# Altium schematic sheet PoE.SchDoc: PoE
size A4; CompanyName: STMicroelectronics; Organization: Microcontrollers Division; DocumentNumber: 13; SheetNumber: 6; SheetTotal: 19
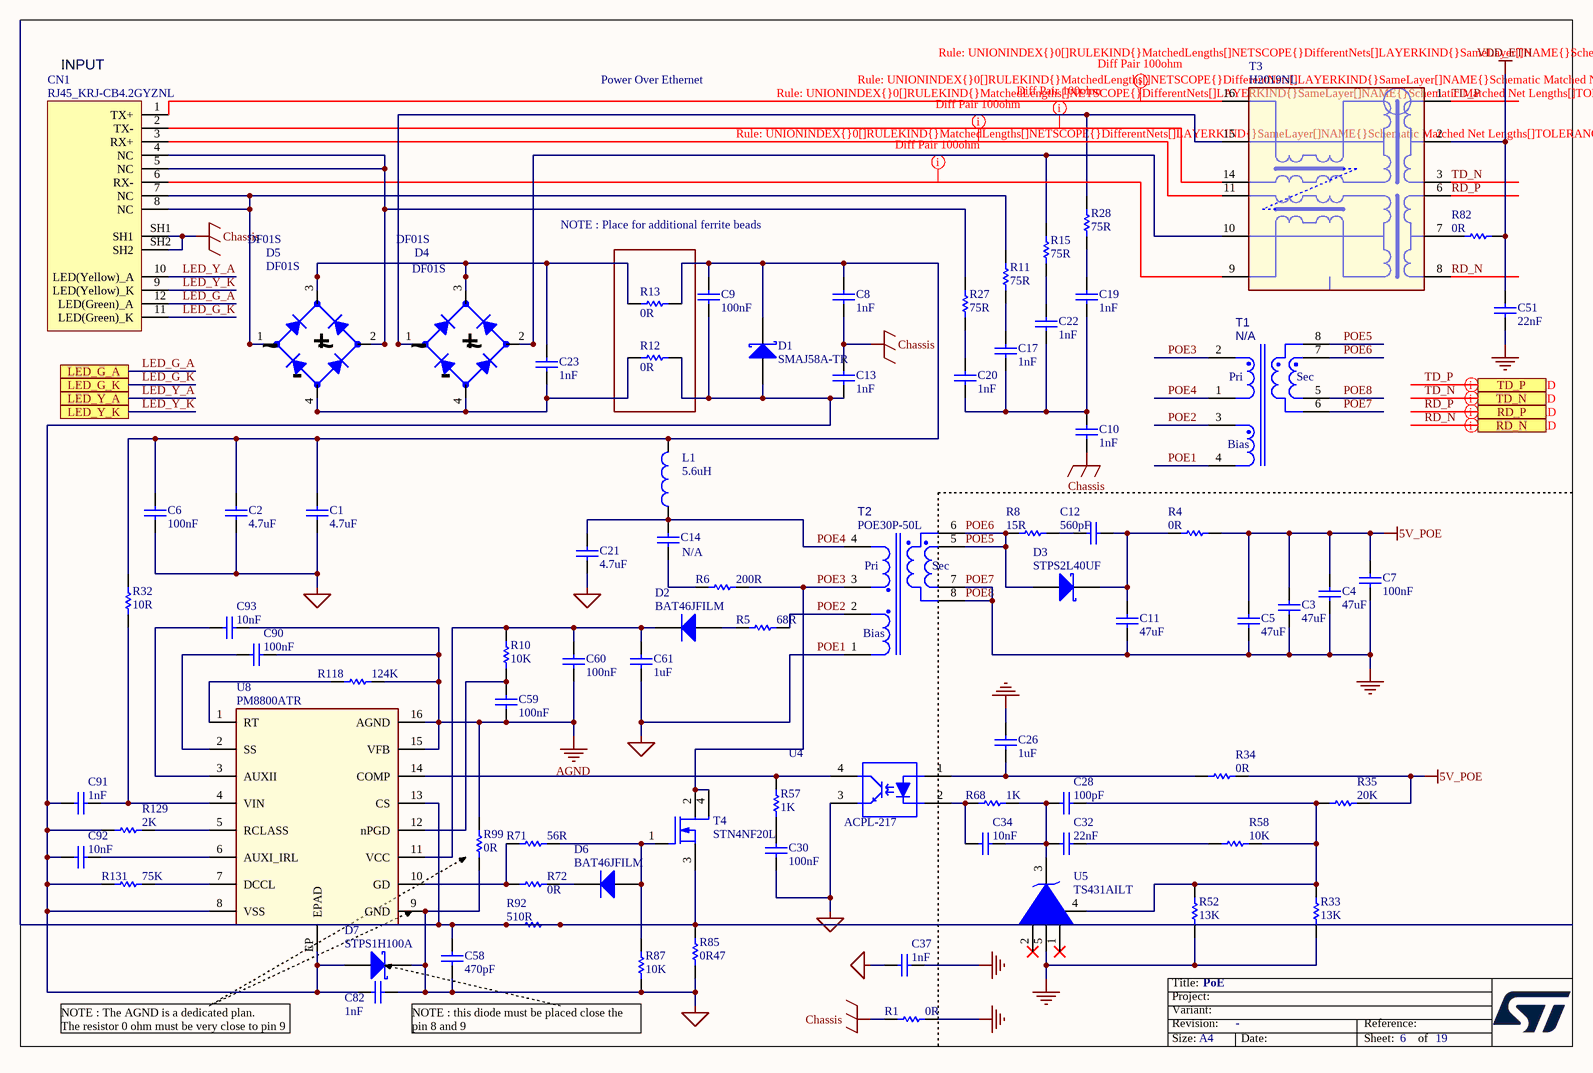
[diagram p0: PoE.SchDoc]

## Parts
C1  value 4.7uF  [C1210]  (hidden comment: Capacitor)
C2  value 4.7uF  [C1210]  (hidden comment: Capacitor)
C3  value 47uF  [C0805]  (hidden comment: Capacitor)
C4  value 47uF  [C0805]  (hidden comment: Capacitor)
C5  value 47uF  [C0805]  (hidden comment: Capacitor)
C6  value 100nF  [C0805]  (hidden comment: Capacitor)
C7  value 100nF  [C0603]  (hidden comment: Capacitor)
C8  value 1nF  [C0603]  (hidden comment: Capacitor)
C9  value 100nF  [C0805]  (hidden comment: Capacitor)
C10  value 1nF  [C1206_H1P6]  (hidden comment: Capacitor)
C11  value 47uF  [C0805]  (hidden comment: Capacitor)
C12  value 560pF  [C0603]  (hidden comment: Capacitor)
C13  value 1nF  [C0603]  (hidden comment: Capacitor)
C14  N/A  [C0603]
C17  value 1nF  [C0603]  (hidden comment: Capacitor)
C19  value 1nF  [C0603]  (hidden comment: Capacitor)
C20  value 1nF  [C0603]  (hidden comment: Capacitor)
C21  value 4.7uF  [C1210]  (hidden comment: Capacitor)
C22  value 1nF  [C0603]  (hidden comment: Capacitor)
C23  value 1nF  [C0603]  (hidden comment: Capacitor)
C26  value 1uF  [C0603]  (hidden comment: Capacitor)
C28  value 100pF  [C0603]  (hidden comment: Capacitor)
C30  value 100nF  [C0603]  (hidden comment: Capacitor)
C32  value 22nF  [C0603]  (hidden comment: Capacitor)
C34  value 10nF  [C0603]  (hidden comment: Capacitor)
C37  value 1nF  [C1206_H1P6]  (hidden comment: Capacitor)
C51  value 22nF  [C0603]  (hidden comment: Capacitor)
C58  value 470pF  [C0603]  (hidden comment: Capacitor)
C59  value 100nF  [C0603]  (hidden comment: Capacitor)
C60  value 100nF  [C0603]  (hidden comment: Capacitor)
C61  value 1uF  [C0603]  (hidden comment: Capacitor)
C82  value 1nF  [C0603]  (hidden comment: Capacitor)
C90  value 100nF  [C0603]  (hidden comment: Capacitor)
C91  value 1nF  [C0603]  (hidden comment: Capacitor)
C92  value 10nF  [C0603]  (hidden comment: Capacitor)
C93  value 10nF  [C0603]  (hidden comment: Capacitor)
CN1  RJ45_KRJ-CB4.2GYZNL  [CON_RJ45_DGKYD_KRJ-CB4.2GYZNL]
D1  value SMAJ58A-TR  [DIO_SMA_1A_2K]  (hidden comment: ​Anode = pin 1)
D2  value BAT46JFILM  [DIO_SOD323_1A_2K]  (hidden comment: DIODE)
D3  value STPS2L40UF  [DIO_SMB-FLAT_1A_2K]  (hidden comment: Anode = pin 1)
D4  DF01S  [BRF_VISHAY_DFS_DF01S]
D5  DF01S  [BRF_VISHAY_DFS_DF01S]
D6  value BAT46JFILM  [DIO_SOD323_1A_2K]  (hidden comment: DIODE)
D7  value STPS1H100A  [DIO_SMA_DO214-AC_1A_2K]  (hidden comment: SMAJ58A-TR)
L1  value 5.6uH  [IND_POWER_COILCRAFT_ME3220]
R1  value 0R  [R0805]  (hidden comment: Resistor)
R4  value 0R  [R0603]  (hidden comment: Resistor)
R5  value 68R  [R0805]  (hidden comment: Resistor)
R6  value 200R  [R1206_H0P55]  (hidden comment: Resistor)
R8  value 15R  [R0805]  (hidden comment: Resistor)
R10  value 10K  [R0603]  (hidden comment: Resistor)
R11  value 75R  [R0805]  (hidden comment: Resistor)
R12  value 0R  [R0805]  (hidden comment: Resistor)
R13  value 0R  [R0805]  (hidden comment: Resistor)
R15  value 75R  [R0805]  (hidden comment: Resistor)
R27  value 75R  [R0805]  (hidden comment: Resistor)
R28  value 75R  [R0805]  (hidden comment: Resistor)
R32  value 10R  [R0805]  (hidden comment: Resistor)
R33  value 13K  [R0603]  (hidden comment: Resistor)
R34  value 0R  [R0805]  (hidden comment: Resistor)
R35  value 20K  [R0603]  (hidden comment: Resistor)
R52  value 13K  [R0603]  (hidden comment: Resistor)
R57  value 1K  [R0603]  (hidden comment: Resistor)
R58  value 10K  [R0603]  (hidden comment: Resistor)
R68  value 1K  [R0603]  (hidden comment: Resistor)
R71  value 56R  [R0805]  (hidden comment: Resistor)
R72  value 0R  [R0805]  (hidden comment: Resistor)
R82  value 0R  [R0805]  (hidden comment: resister)
R85  value 0R47  [R1206_H0P55]  (hidden comment: Resistor)
R87  value 10K  [R0603]  (hidden comment: Resistor)
R92  value 510R  [R0603]  (hidden comment: Resistor)
R99  value 0R  [R0603]  (hidden comment: Resistor)
R118  value 124K  [R0603]  (hidden comment: Resistor)
R129  value 2K  [R0805]  (hidden comment: Resistor)
R131  value 75K  [R0603]  (hidden comment: Resistor)
T1  N/A  [TRS_WURTH_750315923]
T2  value POE30P-50L  [TRS_COILCRAFT_POE30P-50L]
T3  value H2019NL  [TRS_PULSE_H2019NL]
T4  value STN4NF20L  [MOS_SOT223-TAB]
U4  value ACPL-217  [OPT_MINI-FLAT_FAIRCHILD_HMHA2801A]  (hidden comment: HMHA2801A)
U5  TS431AILT  [MOS_SOT23-5L]
U8  value PM8800ATR  [ICC_HTSSOP16-EPAD_5X4P4_P065]

## Ports
LED_G_A, LED_G_K, LED_Y_A, LED_Y_K, RD_N, RD_P, TD_N, TD_P

## Nets
5V_POE: C3.2 C4.2 C5.2 C7.2 R4.2 R34.2 R35.2
AGND: C59.1 C60.1 C90.2 C93.2 R99.2 R118.2 U8.15(VFB) U8.16(AGND)
Chassis: C8.1 C10.1 C13.2 CN1.SH1 CN1.SH2 R1.1
POE1: C1.1 C2.1 C6.1 C21.1 C30.1 C37.1 C58.1 C61.1 C82.1 D7.2(K) R85.1 R87.1 R99.1 T1.4 T2.1 U4.3(Emitter) U8.9(GND)  [also labelled GND_POWER_IN]
POE7: C3.1 C4.1 C5.1 C7.1 C11.1 C26.2 C37.2 C51.1 R1.2 R33.2 R52.1 T1.5 T1.6 T2.7 T2.8 U5.5(A)  [also labelled GND, POE8]
VDD_ETH: C51.2 R82.2 T3.2(tct)
LED_G_A: CN1.12(LED(Green)_A) ; port LED_G_A
LED_G_K: CN1.11(LED(Green)_K) ; port LED_G_K
LED_Y_A: CN1.10(LED(Yellow)_A) ; port LED_Y_A
LED_Y_K: CN1.9(LED(Yellow)_K) ; port LED_Y_K
POE2: R5.2 T1.3 T2.2
POE3: R6.2 T1.2 T2.3 T4.2(D) T4.4(D)
POE4: C14.2 C21.2 L1.1 T1.1 T2.4
POE5: D3.1(A) R8.1 T1.7 T1.8 T2.5 T2.6  [also labelled POE6]
RD_N: T3.8(rd-) ; port RD_N
RD_P: T3.6(rd+) ; port RD_P
TD_N: T3.3(td-) ; port TD_N
TD_P: T3.1(td+) ; port TD_P
NetC1_2: C1.2 C2.2 C6.2 C8.2 C9.1 D1.2(K) L1.2 R13.2 R32.2
NetC9_2: C9.2 C13.1 C82.2 C91.2 C92.1 D1.1(A) D7.1(A) R12.2 R129.1 R131.1 U8.8(VSS) U8.EP(EPAD)
NetC10_2: C10.2 C17.1 C19.1 C20.1 C22.1
NetC11_2: C11.2 C12.2 D3.2(K) R4.1
NetC12_1: C12.1 R8.2
NetC14_1: C14.1 R6.1
NetC17_2: C17.2 R11.1
NetC19_2: C19.2 R28.1
NetC20_2: C20.2 R27.1
NetC22_2: C22.2 R15.1
NetC23_1: C23.1 D4.4(DC_OUT_MINUS) D5.4(DC_OUT_MINUS) R12.1
NetC23_2: C23.2 D4.3(DC_OUT_PLUS) D5.3(DC_OUT_PLUS) R13.1
NetC26_1: C26.1 R34.1 U4.1(Anode)
NetC28_1: C28.1 C32.1 C34.2 R68.1 U5.3(K)
NetC28_2: C28.2 R33.1 R35.1 R52.2 R58.1 U5.4(REF)
NetC30_2: C30.2 R57.1
NetC32_2: C32.2 R58.2
NetC34_1: C34.1 R68.2 U4.2(B)
NetC58_2: C58.2 R85.2 R92.1 R92.2 T4.3(S) U8.13(CS)
NetC59_2: C59.2 R10.1 U8.12(nPGD)
NetC60_2: C60.2 C61.2 D2.2(K) R10.2 U8.11(VCC)
NetC90_1: C90.1 U8.2(SS)
NetC91_1: C91.1 R32.1 U8.4(VIN)
NetC92_2: C92.2 U8.6(AUXI_IRL)
NetC93_1: C93.1 U8.3(AUXII)
NetCN1_1: CN1.1(TX+) T3.16(tx1+)
NetCN1_2: CN1.2(TX-) T3.14(tx1-)
NetCN1_3: CN1.3(RX+) T3.11(rx1+)
NetCN1_4: CN1.4(NC) CN1.5(NC) D5.2(AC_IN_2) R27.2
NetCN1_6: CN1.6(RX-) T3.9(rx-)
NetCN1_7: CN1.7(NC) CN1.8(NC) D5.1(AC_IN_1) R11.2
NetD2_1: D2.1(A) R5.1
NetD4_1: D4.1(AC_IN_1) R28.2 T3.15(txct)
NetD4_2: D4.2(AC_IN_2) R15.2 T3.10(rxct)
NetD6_1: D6.1(A) R71.2 R87.2 T4.1(G)
NetD6_2: D6.2(K) R72.1
NetR57_2: R57.2 U4.4(Collector) U8.14(COMP)
NetR71_1: R71.1 R72.2 U8.10(GD)
NetR82_1: R82.1 T3.7(rct)
NetR118_1: R118.1 U8.1(RT)
NetR129_2: R129.2 U8.5(RCLASS)
NetR131_2: R131.2 U8.7(DCCL)

Not connected (* = marked no-connect by the designer): U5 1(NC)* 2(NC)*

## Layout directives
differential pair: RD_N, RD_P, TD_N, TD_P
rule Matched Net Lengths [Tolerance = 100mil]: NetCN1_1, NetCN1_2, NetCN1_3, NetCN1_6

## Notes on the sheet
- INPUT
- Power Over Ethernet
- NOTE : Place for additional ferrite beads
- NOTE : The AGND is a dedicated plan.
  The resistor 0 ohm must be very close to pin 9
- NOTE : this diode must be placed close the pin 8 and 9
- Title:
- Project:
- Size:
- Revision:
- Variant:
- A4
- -
- Date:
- Reference:
- Sheet:
- of
- (in symbol MCD-01063) Pri; Sec; Bias
- (in symbol MCD-01065) ~; +; -
- (in symbol MCD-01081) Pri; Sec; Bias

## Library data of the parts
C1 C2 C21 = MCD-02212: Capacitor, MLCC, 4.7uF, 100V, X7S, +/-10%, 1210, T=2mm; Manufacturer_Part_Number: CGA6M3X7S2A475K200AB; Manufacturer: TDK; Part_Preference: Recommended; ID: 4312; Order_Code_RS: 111-0119; ShowFields: YES; Component_Country_Of_Origin: Unknown; Internal_Part_Number: MCD-02212; Status: Released; Part_Type: Capacitor; Package: 1210; ComponentLink1URL: http://tunmcdsvn.tun.st.com/Component_Documentation_Library/Trunk/Capacitor/TDK_CGA_Series; Order_Code_Digikey: 445-7005-1-ND; Order_Code_Farnell: 2211140RL
C3-C5 C11 = MCD-00204: Capacitor, MLCC, 47uF, 10V, X5R, 20%, 0805, T=1,25mm; Manufacturer_Part_Number: GRM21BR61A476ME15K; Manufacturer: MURATA; Part_Preference: Recommended; ECCN_US: EAR99; ECCN_EU: NEC; Provided_By: Subcon; Component_Country_Of_Origin: Japan°°; ID: 2664; ShowFields: YES; Internal_Part_Number: MCD-00204; Status: Released; Part_Type: Capacitor; Package: 0805; ComponentLink1Description: Murata_Capacitor_GR_series.pdf; ComponentLink1URL: http://tunmcdsvn.tun.st.com/Component_Documentation_Library/Trunk/Capacitor/MURATA_GRM_Series; Order_Code_Digikey: GRM21BR61A476ME15K-ND; Order_Code_Farnell: N/A; Order_Code_RS: N/A
C6 C9 = MCD-01093: Capacitor,100nF,100V,X7R,10%,0805; Manufacturer_Part_Number: C2012X7R2A104K125AA; Manufacturer: TDK; Part_Preference: Recommended; Provided_By: Subcon; Initial_Board_Reference: MB1381; Component_Country_Of_Origin: Unknown; ID: 3402; Order_Code_RS: 921-4157; ShowFields: YES; Internal_Part_Number: MCD-01093; Status: Checked; Part_Type: Capacitor; Package: 0805; ComponentLink1Description: TDK_Capacitor_C-series Commercial Grade Mid Voltage (100 to 630V).pdf; ComponentLink1URL: http://tunmcdsvn.tun.st.com/Component_Documentation_Library/Trunk/Capacitor/TDK_C_MV_Series; ECCN_US: n/a; ECCN_EU: n/a; Order_Code_Digikey: 445-1418-1-ND; Order_Code_Farnell: 1907331
C7 = MCD-00211: Capacitor, MLCC, 100nF, 16V, X7R, 10%, 0603, T=0,8mm; Manufacturer_Part_Number: CC0603KRX7R7BB104; Manufacturer: YAGEO; Part_Preference: Recommended; Partial_Alternate_Internal_Part_Number: MCD-01099; Provided_By: Subcon; Initial_Board_Reference: MB1319; Component_Country_Of_Origin: China; ID: 2659; Order_Code_RS: 669-8763; ShowFields: YES; Internal_Part_Number: MCD-00211; Status: Released; Part_Type: Capacitor; Package: 0603; ComponentLink1Description: Yageo_Capacitor_X7R-series.pdf; ComponentLink1URL: http://tunmcdsvn.tun.st.com/Component_Documentation_Library/Trunk/Capacitor/YAGEO_X7R_Series; ECCN_US: n/a; ECCN_EU: n/a; Order_Code_Digikey: 311-1088-1-ND; Order_Code_Farnell: 432210
C8 C13 C17 C19 C20 C22 C23 C82 C91 = MCD-01091: Capacitor,1nF,100V,X7R,10%,0603; Manufacturer_Part_Number: CC0603KRX7R0BB102; Manufacturer: YAGEO; Part_Preference: Recommended; Provided_By: Subcon; Initial_Board_Reference: MB1381; Component_Country_Of_Origin: China; ID: 3403; Order_Code_RS: 669-9000; ShowFields: YES; Internal_Part_Number: MCD-01091; Status: Checked; Part_Type: Capacitor; Package: 0603; ComponentLink1Description: Yageo_Multilayer_Capacitor_NPO_X7R_100V_to_630V_0.47pF to 2.2uF.pdf; ComponentLink1URL: http://tunmcdsvn.tun.st.com/Component_Documentation_Library/Trunk/Capacitor/YAGEO_NP0_X7R_MV_Series; ECCN_US: n/a; ECCN_EU: n/a; Order_Code_Digikey: 311-1467-1-ND; Order_Code_Farnell: 1284118
C10 C37 = MCD-00722: Capacitor, MLCC, 1nF, 2KV, X7R, 10%, 1206, T=1,25mm; Manufacturer_Part_Number: CC1206KKX7RDBB102; Manufacturer: YAGEO; Part_Preference: Recommended; Provided_By: Subcon; Initial_Board_Reference: MB1271; Component_Country_Of_Origin: China; ID: 3027; ShowFields: YES; Internal_Part_Number: MCD-00722; Status: Released; Part_Type: Capacitor; Package: 1206; ComponentLink1Description: Yageo_Multilayer_Capacitor_NPO_X7R_1KV_to_3KV_10pF_to_33nF.pdf; ComponentLink1URL: http://tunmcdsvn.tun.st.com/Component_Documentation_Library/Trunk/Capacitor/YAGEO_NP0_X7R_HV_Series; ECCN_US: n/a; ECCN_EU: n/a; Order_Code_Digikey: 311-1487-1-ND; Order_Code_Farnell: 1779513; Order_Code_RS: N/A
C12 = MCD-01095: Capacitor,560pF,16V,X7R,10%,0603; Manufacturer_Part_Number: 0603YC561KAT2A; Manufacturer: AVX; Part_Preference: Recommended; Provided_By: Subcon; Initial_Board_Reference: MB1381; Component_Country_Of_Origin: China; ID: 3400; ShowFields: YES; Internal_Part_Number: MCD-01095; Status: Checked; Part_Type: Capacitor; Package: 0603; ComponentLink1Description: AVX_X7R-series.pdf; ComponentLink1URL: http://tunmcdsvn.tun.st.com/Component_Documentation_Library/Trunk/Capacitor/AVX_X7R_Series; ECCN_US: n/a; ECCN_EU: n/a; Order_Code_Digikey: 0603YC561KAT2A-ND; Order_Code_Farnell: N/A; Order_Code_RS: N/A
C14 = MCD-01096: Capacitor,27pF,100V,NPO,5%,0603; Manufacturer_Part_Number: CC0603JRNPO0BN270; Manufacturer: YAGEO; Part_Preference: Recommended; Provided_By: Subcon; Initial_Board_Reference: MB1381; Component_Country_Of_Origin: China; ID: 3394; ShowFields: YES; Internal_Part_Number: MCD-01096; Value: 27pF; Status: Checked; Part_Type: Capacitor; Package: 0603; ComponentLink1Description: Yageo_Multilayer_Capacitor_NPO_X7R_100V_to_630V_0.47pF to 2.2uF.pdf; ComponentLink1URL: http://tunmcdsvn.tun.st.com/Component_Documentation_Library/Trunk/Capacitor/YAGEO_NP0_X7R_MV_Series; ECCN_US: n/a; ECCN_EU: n/a; Order_Code_Digikey: 311-1757-1-ND; Order_Code_Farnell: N/A; Order_Code_RS: N/A
C26 C61 = MCD-01100: Capacitor,1uF,25V,X5R,10%,0603; Manufacturer_Part_Number: CC0603KRX5R8BB105; Manufacturer: YAGEO; BMS_Part_Number: 9142279; Part_Preference: Recommended; Provided_By: Subcon; Initial_Board_Reference: MB1381; Component_Country_Of_Origin: China; ID: 3398; ShowFields: YES; Internal_Part_Number: MCD-01100; Status: Released; Part_Type: Capacitor; Package: 0603; ComponentLink1Description: Yageo_Multilayer_capacitor_X5R_100pF_to_100uF.pdf; ComponentLink1URL: http://tunmcdsvn.tun.st.com/Component_Documentation_Library/Trunk/Capacitor/YAGEO_X5R_Series; ECCN_US: N/A; ECCN_EU: N/A; Order_Code_Digikey: 311-1445-1-ND; Order_Code_Farnell: 2370681; Order_Code_RS: N/A
C28 = MCD-01101: Capacitor,100pF,50V,X7R,10%,0603; Manufacturer_Part_Number: 06035C101JAT4A; Manufacturer: AVX; Part_Preference: Recommended; Provided_By: Subcon; Initial_Board_Reference: MB1381; Component_Country_Of_Origin: China; ID: 3399; ShowFields: YES; Internal_Part_Number: MCD-01101; Status: Checked; Part_Type: Capacitor; Package: 0603; ComponentLink1Description: AVX_X7R-series.pdf; ComponentLink1URL: http://tunmcdsvn.tun.st.com/Component_Documentation_Library/Trunk/Capacitor/AVX_X7R_Series; ECCN_US: n/a; ECCN_EU: n/a; Order_Code_Digikey: 06035C101JAT4A-ND; Order_Code_Farnell: 2332634; Order_Code_RS: N/A
C30 C59 C60 C90 = MCD-01099: Capacitor,100nF,50V,X7R,10%,0603; Manufacturer_Part_Number: CC0603KRX7R9BB104; Manufacturer: YAGEO; BMS_Part_Number: 9142278; Part_Preference: Recommended; Provided_By: Subcon; Initial_Board_Reference: MB1381; Component_Country_Of_Origin: China; ID: 3397; Order_Code_RS: 669-8767; ShowFields: YES; Internal_Part_Number: MCD-01099; Status: Released; Part_Type: Capacitor; Package: 0603; ComponentLink1Description: Yageo_Mutilayer_Capacitor_X7R_100pF_to_22uF.pdf; ComponentLink1URL: http://tunmcdsvn.tun.st.com/Component_Documentation_Library/Trunk/Capacitor/YAGEO_X7R_Series; ECCN_US: n/a; ECCN_EU: n/a; Order_Code_Digikey: 311-1344-1-ND; Order_Code_Farnell: 1362556; Partial_Alternate_Internal_Part_Number: MCD-0211
C32 C51 = MCD-01103: Capacitor,22nF,50V,X7R,10%,0603; Manufacturer_Part_Number: CC0603KRX7R9BB223; Manufacturer: YAGEO; BMS_Part_Number: 9142231; Part_Preference: Recommended; Provided_By: Subcon; Initial_Board_Reference: MB1381; Component_Country_Of_Origin: China; ID: 3390; ShowFields: YES; Internal_Part_Number: MCD-01103; Status: Checked; Part_Type: Capacitor; Package: 0603; ComponentLink1Description: Yageo_Mutilayer_Capacitor_X7R_100pF_to_22uF.pdf; ComponentLink1URL: http://tunmcdsvn.tun.st.com/Component_Documentation_Library/Trunk/Capacitor/YAGEO_X7R_Series; ECCN_US: n/a; ECCN_EU: n/a; Order_Code_Digikey: 311-1370-1-ND; Order_Code_Farnell: 3019755; Order_Code_RS: N/A
C34 = MCD-00017: Capacitor, MLCC, 10nF, 50V, X7R, +/-10%, 0603, T=0.8mm; Manufacturer_Part_Number: CC0603KRX7R9BB103; Manufacturer: YAGEO; Part_Preference: Recommended; Component_Country_Of_Origin: China; ID: 2500; Order_Code_RS: 722236; ShowFields: YES; Internal_Part_Number: MCD-00017; Status: Released; Part_Type: Capacitor; ComponentLink1URL: http://tunmcdsvn.tun.st.com/Component_Documentation_Library/Trunk/Capacitor/YAGEO_X7R_Series; Order_Code_Digikey: 311-1085-1-ND; Order_Code_Farnell: 722236; Package: 0603
C58 = MCD-01104: Capacitor,470pF,100V,X7R,10%,0603; Manufacturer_Part_Number: 06031C471KAT2A; Manufacturer: AVX; Part_Preference: Recommended; Partial_Alternate_Internal_Part_Number: MCD-01731; Provided_By: Subcon; Initial_Board_Reference: MB1381; Component_Country_Of_Origin: China; ID: 3393; Order_Code_RS: 888-2112; ShowFields: YES; Internal_Part_Number: MCD-01104; Status: Checked; Part_Type: Capacitor; Package: 0603; ComponentLink1Description: AVX_Capacitor_X7S-Dielectric.pdf; ComponentLink1URL: http://tunmcdsvn.tun.st.com/Component_Documentation_Library/Trunk/Capacitor/AVX_X7S_Series; ECCN_US: n/a; ECCN_EU: n/a; Order_Code_Digikey: 478-1197-1-ND; Order_Code_Farnell: 2280645
C92 C93 = MCD-01098: Capacitor,10nF,100V,X7R,10%,0603; Manufacturer_Part_Number: CC0603KRX7R0BB103; Manufacturer: YAGEO; Part_Preference: Recommended; Provided_By: Subcon; Initial_Board_Reference: MB1381; Component_Country_Of_Origin: China; ID: 3396; ShowFields: YES; Internal_Part_Number: MCD-01098; Status: Checked; Part_Type: Capacitor; Package: 0603; ComponentLink1Description: Yageo_Multilayer_Capacitor_NPO_X7R_100V_to_630V_0.47pF to 2.2uF.pdf; ComponentLink1URL: http://tunmcdsvn.tun.st.com/Component_Documentation_Library/Trunk/Capacitor/YAGEO_NP0_X7R_MV_Series; ECCN_US: n/a; ECCN_EU: n/a; Order_Code_Digikey: 311-1788-1-ND; Order_Code_Farnell: 1284119; Order_Code_RS: N/A
CN1 = MCD-00717: RJ45 jack, single port, with LEDS, Metal shielded dip low profile; Part_Type: Connector; Manufacturer: DONGGUAN KEYOUDA ELECTRONIC TECHNOLOGY; Part_Preference: Recommended; Provided_By: Subcon; Initial_Board_Reference: MB1271; Component_Country_Of_Origin: Unknown; ID: 3029; ShowFields: YES; Internal_Part_Number: MCD-00717; Value: RJ45_KRJ-CB4.2GYZNL; Status: Released; Manufacturer_Part_Number: KRJ-CB4.2GYZNL; ComponentLink1Description: DGKYD_RJ45_KRJ-CB4.2GYZNL; ComponentLink1URL: http://tunmcdsvn.tun.st.com/Component_Documentation_Library/Trunk/Connector/DONGGUAN_KEYOUDA_ELECTRONIC_TECHNOLOGY_KRJ-CB4.2GYZNL/; ECCN_US: n/a; ECCN_EU: n/a; Order_Code_Digikey: N/A; Order_Code_Farnell: N/A; Order_Code_RS: N/A
D1 = MCD-01083: Transil 400W, VRM=58V; Part_Type: Diode; Manufacturer: STMICROELECTRONICS; BMS_Part_Number: 9151124; Manufacturer_HQ_COO: EU; Part_Preference: Recommended; ECCN_US: EAR99; ECCN_EU: NEC; Provided_By: Subcon; Initial_Board_Reference: MB1381; Component_Country_Of_Origin: China; ID: 3407; Order_Code_RS: 714-7128; ShowFields: YES; Internal_Part_Number: MCD-01083; Status: Released; Manufacturer_Part_Number: SMAJ58A-TR; Package: SMA; ComponentLink1Description: STM_Diode_SMAJ58A-TR.pdf; ComponentLink1URL: http://tunmcdsvn.tun.st.com/Component_Documentation_Library/Trunk/Diode/STMICROELECTRONICS_SMAJ_Series; Order_Code_Digikey: 497-3508-2-ND; Order_Code_Farnell: 1373661
D2 D6 = MCD-01064: Schottky Single diode,150mA, 100V; Manufacturer: STMICROELECTRONICS; BMS_Part_Number: 9151125; Manufacturer_HQ_COO: EU; Part_Preference: Recommended; ECCN_US: EAR99; ECCN_EU: NEC; Provided_By: Subcon; Initial_Board_Reference: MB1381; ID: 3424; Order_Code_RS: 714-6847; ShowFields: YES; Internal_Part_Number: MCD-01064; Status: Released; Part_Type: Diode; Manufacturer_Part_Number: BAT46JFILM; Package: SOD323; ComponentLink1Description: STM_Diode_BAT60JFILM-SOD323.pdf; ComponentLink1URL: http://tunmcdsvn.tun.st.com/Component_Documentation_Library/Trunk/Diode/STMICROELECTRONICS_BAT60J_Series; Order_Code_Digikey: 497-6653-2-ND; Order_Code_Farnell: 2341641
D3 = MCD-01087: Low drop power Schottky rectifier(2A, 40V, 0.34V); Part_Type: Diode; Manufacturer: STMICROELECTRONICS; BMS_Part_Number: 9151009; Manufacturer_HQ_COO: EU; Part_Preference: Recommended; ECCN_US: EAR99; ECCN_EU: NEC; Provided_By: Subcon; Initial_Board_Reference: MB1381; Component_Country_Of_Origin: China; ID: 3406; ShowFields: YES; Internal_Part_Number: MCD-01087; Status: Released; Manufacturer_Part_Number: STPS2L40UF; Package: SMBflat; ComponentLink1Description: STM_Schottky_STPS2L40UF.pdf; ComponentLink1URL: http://tunmcdsvn.tun.st.com/Component_Documentation_Library/Trunk/Diode/STMICROELECTRONICS_STPS2L40_Series; Order_Code_Digikey: 497-8031-2-ND; Order_Code_Farnell: 3214533; Order_Code_RS: N/A
D4 D5 = MCD-01065: IC, Bridge Rectifiers, Miniature Glass Passivated Single-Phase, Surface Mount; Part_Preference: Forbidden; Manufacturer: VISHAY; ShowFields: YES; ID: 3428; Internal_Part_Number: MCD-01065; Status: Obsolete; Part_Type: IC; Manufacturer_Part_Number: DF01S; Package: DFS; ComponentLink1URL: http://tunmcdsvn.tun.st.com/Component_Documentation_Library/Trunk/IC/VISHAY_DF01S; Order_Code_Digikey: N/A; Order_Code_Farnell: N/A; Order_Code_RS: N/A; Value: DF01S
D7 = MCD-01165: High voltage power Schottky rectifier; Part_Type: Diode; Manufacturer: STMICROELECTRONICS; BMS_Part_Number: 9151102; Manufacturer_HQ_COO: EU; Part_Preference: Forbidden; ECCN_US: EAR99; ECCN_EU: NEC; Provided_By: Subcon; Initial_Board_Reference: MB1381; ID: 3327; Order_Code_RS: 249-892; ShowFields: YES; Internal_Part_Number: MCD-01165; Status: Released; Manufacturer_Part_Number: STPS1H100A; ComponentLink1Description: http://tunmcdsvn.tun.st.com/Component_Datasheet_Library/Trunk/Diodes/STM_SCHOTTKY_STPS1H100A; ComponentLink1URL: http://tunmcdsvn.tun.st.com/Component_Documentation_Library/Trunk/Diode/STMICROELECTRONICS_STPS1H100_Series; Order_Code_Digikey: 497-3209-2-ND; Order_Code_Farnell: 1467549; Package: SMB
L1 = MCD-01109: Power Inductor, 5.6uH, 0.2R, ME3220-562ML; Manufacturer: COILCRAFT; Part_Preference: Recommended; Provided_By: Subcon; Initial_Board_Reference: MB1381; Component_Country_Of_Origin: Unknown; ID: 3389; ShowFields: YES; Internal_Part_Number: MCD-01109; Status: Checked; Part_Type: Inductor; Manufacturer_Part_Number: ME3220-562ML; ComponentLink1Description: CoilCraft_SMT Power Inductor ME3220.pdf; ComponentLink1URL: http://tunmcdsvn.tun.st.com/Component_Documentation_Library/Trunk/Inductor/COILCRAFT_ME3220_Series; ECCN_US: n/a; ECCN_EU: n/a; Order_Code_Digikey: N/A; Order_Code_Farnell: 2287944; Order_Code_RS: N/A; Package: 1210
R1 R12 R13 R34 R72 R82 = MCD-00179: Resistor,0R,0805,5%; Manufacturer_Part_Number: RC0805JR-070RL; Manufacturer: YAGEO; Part_Preference: Recommended; Provided_By: Subcon; Component_Country_Of_Origin: China; ID: 2685; ShowFields: YES; Internal_Part_Number: MCD-00179; Status: Released; Part_Type: Resistor; Package: 0805; ComponentLink1Description: Yageo_Resistor_RC0805-series.pdf; ComponentLink1URL: http://tunmcdsvn.tun.st.com/Component_Documentation_Library/Trunk/Resistor/YAGEO_RC_L_Series; ECCN_US: n/a; ECCN_EU: n/a; Order_Code_Digikey: 311-0.0ARCT-ND; Order_Code_Farnell: 9233750; Order_Code_RS: N/A
R4 R99 = MCD-00056: Resistor,0R,0603,5%,1/10W; Manufacturer_Part_Number: RC0603JR-070RL; Manufacturer: YAGEO; Part_Preference: Recommended; Provided_By: subcon; Initial_Board_Reference: MB1274; Component_Country_Of_Origin: China; ID: 2536; Order_Code_RS: 9233130RL; ShowFields: YES; Internal_Part_Number: MCD-00056; Status: Released; Part_Type: Resistor; Package: 0603; ComponentLink1Description: Yageo_Resistor_RC0603-series.pdf; ComponentLink1URL: http://tunmcdsvn.tun.st.com/Component_Documentation_Library/Trunk/Resistor/YAGEO_RC_L_Series; ECCN_US: n/a; ECCN_EU: n/a; Order_Code_Digikey: 311-0.0GRCT-ND; Order_Code_Farnell: 9233130RL
R5 = MCD-01115: Resistor,68R,0805,1%; Manufacturer_Part_Number: RC0805FR-0768RL; Manufacturer: YAGEO; Part_Preference: Recommended; Provided_By: Subcon; Initial_Board_Reference: MB1381; Component_Country_Of_Origin: China; ID: 3379; ShowFields: YES; Internal_Part_Number: MCD-01115; Status: Checked; Part_Type: Resistor; Package: 0805; ComponentLink1Description: Yageo_Resistor_RC0805-series.pdf; ComponentLink1URL: http://tunmcdsvn.tun.st.com/Component_Documentation_Library/Trunk/Resistor/YAGEO_RC_L_Series; ECCN_US: n/a; ECCN_EU: n/a; Order_Code_Digikey: 311-68.0CRCT-ND; Order_Code_Farnell: 9237348; Order_Code_RS: N/A
R6 = MCD-01114: Resistor,200R,1206,1%; Manufacturer_Part_Number: LTR18EZPF2000; Manufacturer: ROHM SEMICONDUCTOR; Part_Preference: Recommended; Provided_By: Subcon; Initial_Board_Reference: MB1381; Component_Country_Of_Origin: Philippines, Thailand°°; ID: 3381; ShowFields: YES; Internal_Part_Number: MCD-01114; Status: Released; Part_Type: Resistor; Package: 1206; ComponentLink1Description: ROHM_Resistor_LTR-series.pdf; ComponentLink1URL: http://tunmcdsvn.tun.st.com/Component_Documentation_Library/Trunk/Resistor/ROHM_LTR_Series; ECCN_US: n/a; ECCN_EU: n/a; Order_Code_Digikey: RHM200YCT-ND; Order_Code_Farnell: N/A; Order_Code_RS: N/A
R8 = MCD-01113: Resistor,15R,0805,1%; Manufacturer_Part_Number: RC0805FR-0715RL; Manufacturer: YAGEO; Part_Preference: Recommended; Provided_By: Subcon; Initial_Board_Reference: MB1381; Component_Country_Of_Origin: China; ID: 3383; Order_Code_RS: 618-3476; ShowFields: YES; Internal_Part_Number: MCD-01113; Status: Released; Part_Type: Resistor; Package: 0805; ComponentLink1Description: Yageo_Resistor_RC0805-series.pdf; ComponentLink1URL: http://tunmcdsvn.tun.st.com/Component_Documentation_Library/Trunk/Resistor/YAGEO_RC_L_Series; ECCN_US: n/a; ECCN_EU: n/a; Order_Code_Digikey: 311-15.0CRCT-ND; Order_Code_Farnell: 9237267
R10 R58 R87 = MCD-00220: Resistor,10K,0603,1%,1/10W; Manufacturer_Part_Number: RC0603FR-0710KL; Manufacturer: YAGEO; Part_Preference: Recommended; Provided_By: Subcon; Initial_Board_Reference: MB1319; Component_Country_Of_Origin: China; ID: 2649; ShowFields: YES; Internal_Part_Number: MCD-00220; Status: Released; Part_Type: Resistor; Package: 0603; ComponentLink1Description: Yageo_Resistor_RC0603-series.pdf; ComponentLink1URL: http://tunmcdsvn.tun.st.com/Component_Documentation_Library/Trunk/Resistor/YAGEO_RC_L_Series; ECCN_US: n/a; ECCN_EU: n/a; Order_Code_Digikey: 311-10.0KHRCT-ND; Order_Code_Farnell: 9238603; Order_Code_RS: N/A
R11 R15 R27 R28 = MCD-01112: Resistor,75R,0805,1%; Manufacturer_Part_Number: RC0805FR-0775RL; Manufacturer: YAGEO; Part_Preference: Recommended; Provided_By: Subcon; Initial_Board_Reference: MB1381; Component_Country_Of_Origin: China; ID: 3380; ShowFields: YES; Internal_Part_Number: MCD-01112; Status: Released; Part_Type: Resistor; Package: 0805; ComponentLink1Description: Yageo_Resistor_RC0805-series.pdf; ComponentLink1URL: http://tunmcdsvn.tun.st.com/Component_Documentation_Library/Trunk/Resistor/YAGEO_RC_L_Series; ECCN_US: n/a; ECCN_EU: n/a; Order_Code_Digikey: 311-75.0CRCT-ND; Order_Code_Farnell: N/A; Order_Code_RS: N/A
R32 = MCD-01111: Resistor,10R,0805,1%,Stackpole,1/4W; Manufacturer_Part_Number: RNCP0805FTD10R0; Part_Preference: Recommended; Provided_By: Subcon; Initial_Board_Reference: MB1381; Component_Country_Of_Origin: Taiwan°; ID: 3385; ShowFields: YES; Internal_Part_Number: MCD-01111; Status: Released; Part_Type: Resistor; Manufacturer: STACKPOLE; Package: 0805; ComponentLink1Description: Stackpole_Resisteor_RNCP Series.pdf; ComponentLink1URL: http://tunmcdsvn.tun.st.com/Component_Documentation_Library/Trunk/Resistor/STACKPOLE_RNCP_Series; ECCN_US: n/a; ECCN_EU: n/a; Order_Code_Digikey: RNCP0805FTD10R0CT-ND; Order_Code_Farnell: N/A; Order_Code_RS: N/A
R33 R52 = MCD-00384: Resistor,13K,0603,1%,1/10W; Manufacturer_Part_Number: RC0603FR-0713KL; Manufacturer: YAGEO; Part_Preference: Recommended; Provided_By: Subcon; Component_Country_Of_Origin: China; ID: 2894; ShowFields: YES; Internal_Part_Number: MCD-00384; Status: Released; Part_Type: Resistor; Package: 0603; ComponentLink1Description: Yageo_Resistor_RC0603-series.pdf; ComponentLink1URL: http://tunmcdsvn.tun.st.com/Component_Documentation_Library/Trunk/Resistor/YAGEO_RC_L_Series; ECCN_US: n/a; ECCN_EU: n/a; Order_Code_Digikey: 311-13.0KHRCT-ND; Order_Code_Farnell: 1799325; Order_Code_RS: N/A
R35 = MCD-00422: Resistor,20K,0603,1%,1/10W; Manufacturer_Part_Number: RC0603FR-0720KL; Manufacturer: YAGEO; Part_Preference: Recommended; Provided_By: Subcon; Component_Country_Of_Origin: China; ID: 2854; ShowFields: YES; Internal_Part_Number: MCD-00422; Status: Released; Part_Type: Resistor; Package: 0603; ComponentLink1Description: Yageo_Resistor_RC0603-series.pdf; ComponentLink1URL: http://tunmcdsvn.tun.st.com/Component_Documentation_Library/Trunk/Resistor/YAGEO_RC_L_Series; ECCN_US: n/a; ECCN_EU: n/a; Order_Code_Digikey: 311-20.0KHRCT-ND; Order_Code_Farnell: 1799331; Order_Code_RS: N/A
R57 R68 = MCD-00070: Resistor,1K,0603,1%,1/10W; Manufacturer_Part_Number: RC0603FR-071KL; Manufacturer: YAGEO; Part_Preference: Recommended; Provided_By: Subcon; Initial_Board_Reference: MB1274; Component_Country_Of_Origin: China; ID: 2522; Order_Code_RS: 9238484RL; ShowFields: YES; Internal_Part_Number: MCD-00070; Status: Released; Part_Type: Resistor; Package: 0603; ComponentLink1Description: Yageo_Resistor_RC0603-series.pdf; ComponentLink1URL: http://tunmcdsvn.tun.st.com/Component_Documentation_Library/Trunk/Resistor/YAGEO_RC_L_Series; ECCN_US: n/a; ECCN_EU: n/a; Order_Code_Digikey: 311-1.00KHRCT-ND; Order_Code_Farnell: 9238484RL
R71 = MCD-01118: Resistor,56R,0805,1%; Manufacturer_Part_Number: RC0805FR-0756RL; Manufacturer: YAGEO; Part_Preference: Recommended; Provided_By: Subcon; Initial_Board_Reference: MB1381; Component_Country_Of_Origin: China; ID: 3376; ShowFields: YES; Internal_Part_Number: MCD-01118; Status: Checked; Part_Type: Resistor; Package: 0805; ComponentLink1Description: Yageo_Resistor_RC0805-series.pdf; ComponentLink1URL: http://tunmcdsvn.tun.st.com/Component_Documentation_Library/Trunk/Resistor/YAGEO_RC_L_Series; ECCN_US: n/a; ECCN_EU: n/a; Order_Code_Digikey: 311-56.0CRCT-ND; Order_Code_Farnell: 9237330; Order_Code_RS: N/A
R85 = MCD-01119: Resistor,0.47R,1206,1%; Manufacturer_Part_Number: RL1206FR-070R47L; Manufacturer: YAGEO; Part_Preference: Recommended; Provided_By: Subcon; Initial_Board_Reference: MB1381; Component_Country_Of_Origin: Taiwan; ID: 3382; ShowFields: YES; Internal_Part_Number: MCD-01119; Status: Checked; Part_Type: Resistor; Package: 1206; ComponentLink1Description: Yageo_Resistor_RL-series.pdf; ComponentLink1URL: http://tunmcdsvn.tun.st.com/Component_Documentation_Library/Trunk/Resistor/YAGEO_RL_Series; ECCN_US: n/a; ECCN_EU: n/a; Order_Code_Digikey: 311-.47LWCT-ND; Order_Code_Farnell: 1779456; Order_Code_RS: N/A
R92 = MCD-00225: Resistor,510R,0603,1%,1/10W; Manufacturer_Part_Number: RC0603FR-07510RL; Manufacturer: YAGEO; Part_Preference: Recommended; Provided_By: Subcon; Initial_Board_Reference: MB1319; Component_Country_Of_Origin: China; ID: 2644; ShowFields: YES; Internal_Part_Number: MCD-00225; Status: Released; Part_Type: Resistor; Package: 0603; ComponentLink1Description: Yageo_Resistor_RC0603-series.pdf; ComponentLink1URL: http://tunmcdsvn.tun.st.com/Component_Documentation_Library/Trunk/Resistor/YAGEO_RC_L_Series; ECCN_US: n/a; ECCN_EU: n/a; Order_Code_Digikey: 311-510HRCT-ND; Order_Code_Farnell: 1799351; Order_Code_RS: N/A
R118 = MCD-01116: Resistor,124K,0603,1%; Manufacturer_Part_Number: RC0603FR-07124KL; Manufacturer: YAGEO; Part_Preference: Recommended; Provided_By: Subcon; Initial_Board_Reference: MB1381; Component_Country_Of_Origin: China; ID: 3377; ShowFields: YES; Internal_Part_Number: MCD-01116; Status: Released; Part_Type: Resistor; Package: 0603; ComponentLink1Description: Yageo_Resistor_RC0603-series.pdf; ComponentLink1URL: http://tunmcdsvn.tun.st.com/Component_Documentation_Library/Trunk/Resistor/YAGEO_RC_L_Series; ECCN_US: n/a; ECCN_EU: n/a; Order_Code_Digikey: 311-124KHRCT-ND; Order_Code_Farnell: N/A; Order_Code_RS: N/A
R129 = MCD-01117: Resistor,2K,0805,1%; Manufacturer_Part_Number: RC0805FR-072KL; Manufacturer: YAGEO; Part_Preference: Recommended; Provided_By: Subcon; Initial_Board_Reference: MB1381; Component_Country_Of_Origin: China; ID: 3378; ShowFields: YES; Internal_Part_Number: MCD-01117; Status: Released; Part_Type: Resistor; Package: 0805; ComponentLink1Description: Yageo_Resistor_RC0805-series.pdf; ComponentLink1URL: http://tunmcdsvn.tun.st.com/Component_Documentation_Library/Trunk/Resistor/YAGEO_RC_L_Series; ECCN_US: n/a; ECCN_EU: n/a; Order_Code_Digikey: 311-2.00KCRCT-ND; Order_Code_Farnell: 1857143; Order_Code_RS: N/A
R131 = MCD-00522: Resistor,75K,0603,1%,1/10W; Manufacturer_Part_Number: RC0603FR-0775KL; Manufacturer: YAGEO; Part_Preference: Recommended; Provided_By: Subcon; Component_Country_Of_Origin: China; ID: 3221; ShowFields: YES; Internal_Part_Number: MCD-00522; Status: Released; Part_Type: Resistor; Package: 0603; ComponentLink1Description: Yageo_Resistor_RC0603-series.pdf; ComponentLink1URL: http://tunmcdsvn.tun.st.com/Component_Documentation_Library/Trunk/Resistor/YAGEO_RC_L_Series; ECCN_US: n/a; ECCN_EU: n/a; Order_Code_Digikey: 311-75.0KHRCT-ND; Order_Code_Farnell: 1799354; Order_Code_RS: N/A
T1 = MCD-01063: Flyback Transformers for 3 Watt, PoE applications; Part_Type: IC; Manufacturer: WURTH ELEKTRONIK; Part_Preference: Recommended; Value: 750315923; Provided_By: Subcon; Initial_Board_Reference: MB1381; Component_Country_Of_Origin: Unknown; ID: 3426; ShowFields: YES; Internal_Part_Number: MCD-01063; Status: Checked; Manufacturer_Part_Number: 750315923; ComponentLink1Description: Wurth_Transformer_750315923.pdf; ComponentLink1URL: http://tunmcdsvn.tun.st.com/Component_Documentation_Library/Trunk/IC/WURTH_ELEKTRONIK_750315923; ECCN_US: n/a; ECCN_EU: n/a; Order_Code_Digikey: N/A; Order_Code_Farnell: N/A; Order_Code_RS: N/A; Package: 12.85x12.04x6.1mm
T2 = MCD-01081: Flyback Transformers for 3 Watt, PoE applications, CoilCraft Cyntec; Part_Type: IC; Part_Preference: Recommended; Provided_By: Subcon; Initial_Board_Reference: MB1381; Component_Country_Of_Origin: Unknown; ID: 3409; ShowFields: YES; Internal_Part_Number: MCD-01081; Status: Released; Manufacturer_Part_Number: POE30P-50L; Manufacturer: COILCRAFT; ComponentLink1Description: CoilCraft_Transformer_POE30P-50L.pdf; ComponentLink1URL: http://tunmcdsvn.tun.st.com/Component_Documentation_Library/Trunk/IC/COILCRAFT_POE30P-50L; ECCN_US: n/a; ECCN_EU: n/a; Order_Code_Digikey: N/A; Order_Code_Farnell: 2458016; Order_Code_RS: N/A; Package: 13.21x10.92x9.02mm
T3 = MCD-01067: 10/100BASE-TX VoIP Magnetics Modules, Data Transformer; Part_Type: IC; Manufacturer: PULSE ELECTRONICS; Part_Preference: Recommended; ECCN_US: EAR99; ECCN_EU: NEC; Provided_By: Subcon; Initial_Board_Reference: MB1381; Component_Country_Of_Origin: China; ID: 3423; ShowFields: YES; Internal_Part_Number: MCD-01067; Status: Released; Manufacturer_Part_Number: H2019NL; ComponentLink1Description: Pulse_Transformer_H2019NL.pdf; ComponentLink1URL: http://tunmcdsvn.tun.st.com/Component_Documentation_Library/Trunk/IC/PULSE_ELECTRONICS_H2019NL; Order_Code_Digikey: N/A; Order_Code_Farnell: N/A; Order_Code_RS: N/A; Package: 9.4x12.7x5.97mm
T4 = MCD-01086: Annel 200 V, 1.1ohm, 1 A, low gate charge STripFET II, Power MOSFET; Part_Type: Transistor; Manufacturer: STMICROELECTRONICS; BMS_Part_Number: 9153018; Manufacturer_HQ_COO: EU; Part_Preference: Forbidden; ECCN_US: EAR99; ECCN_EU: NEC; Provided_By: Subcon; Initial_Board_Reference: MB1381; Component_Country_Of_Origin: China; ID: 3405; ShowFields: YES; Internal_Part_Number: MCD-01086; Status: Released; Manufacturer_Part_Number: STN4NF20L; Package: SOT223; ComponentLink1Description: STM_N-channel_MOSFET_STN4NF20L.pdf; ComponentLink1URL: http://tunmcdsvn.tun.st.com/Component_Documentation_Library/Trunk/IC/STMICROELECTRONICS_STN4NF20L; Order_Code_Digikey: 497-10779-2-ND; Order_Code_Farnell: 2629750; Order_Code_RS: N/A
U4 = MCD-03054: IC, Half-Pitch Phototransistor Optocoupler, DC Input, 3750V, SO-4; Part_Preference: Recommended; Manufacturer: BROADCOM LIMITED; Manufacturer_Part_Number: ACPL-217-560E; Component_Country_Of_Origin: Singapore°; ShowFields: YES; ID: 5170; Internal_Part_Number: MCD-03054; Status: Checked; Part_Type: IC; Package: SO-4; ComponentLink1URL: http://tunmcdsvn.tun.st.com/Component_Documentation_Library/Trunk/IC/BROADCOM_LIMITED_ACPL-217-560; Order_Code_Digikey: 516-2895-2-ND; Order_Code_Farnell: 1602621; Order_Code_RS: N/A
U5 = MCD-01089: Low voltage adjustable shunt reference; Part_Type: IC; Manufacturer: STMICROELECTRONICS; BMS_Part_Number: 9177032; Manufacturer_HQ_COO: EU; Part_Preference: Recommended; ECCN_US: EAR99; ECCN_EU: NEC; Provided_By: Subcon; Initial_Board_Reference: MB1381; Component_Country_Of_Origin: Malaysia; ID: 3404; ShowFields: YES; Internal_Part_Number: MCD-01089; Value: TS431AILT; Status: Released; Manufacturer_Part_Number: TS431AILT; Package: SOT23-5; ComponentLink1Description: STM_shunt voltage reference_TS431AILT.pdf; ComponentLink1URL: http://tunmcdsvn.tun.st.com/Component_Documentation_Library/Trunk/IC/STMICROELECTRONICS_TS431AILT; Order_Code_Digikey: 497-2279-2-ND; Order_Code_Farnell: N/A; Order_Code_RS: N/A
U8 = MCD-01080: Integrated IEEE 802.3af compliant PoE-PD interface, and PWM controller with support of external source; Part_Type: IC; Manufacturer: STMICROELECTRONICS; BMS_Part_Number: 9177966; Manufacturer_HQ_COO: EU; Part_Preference: Forbidden; ECCN_US: EAR99; ECCN_EU: NEC; Provided_By: Subcon; Initial_Board_Reference: MB1381; Component_Country_Of_Origin: Philippines; ID: 3410; ShowFields: YES; Internal_Part_Number: MCD-01080; Status: Obsolete; Manufacturer_Part_Number: PM8800ATR; Package: HTSSOP-16; ComponentLink1Description: STM_PWM Controller_PM8800ATR.pdf; ComponentLink1URL: http://tunmcdsvn.tun.st.com/Component_Documentation_Library/Trunk/IC/STMICROELECTRONICS_PM8800ATR; Order_Code_Digikey: 497-6897-2-ND; Order_Code_Farnell: 3129650; Order_Code_RS: N/A